# EAGLE design FetchControllerV2R2 (EAGLE 9.6.2)
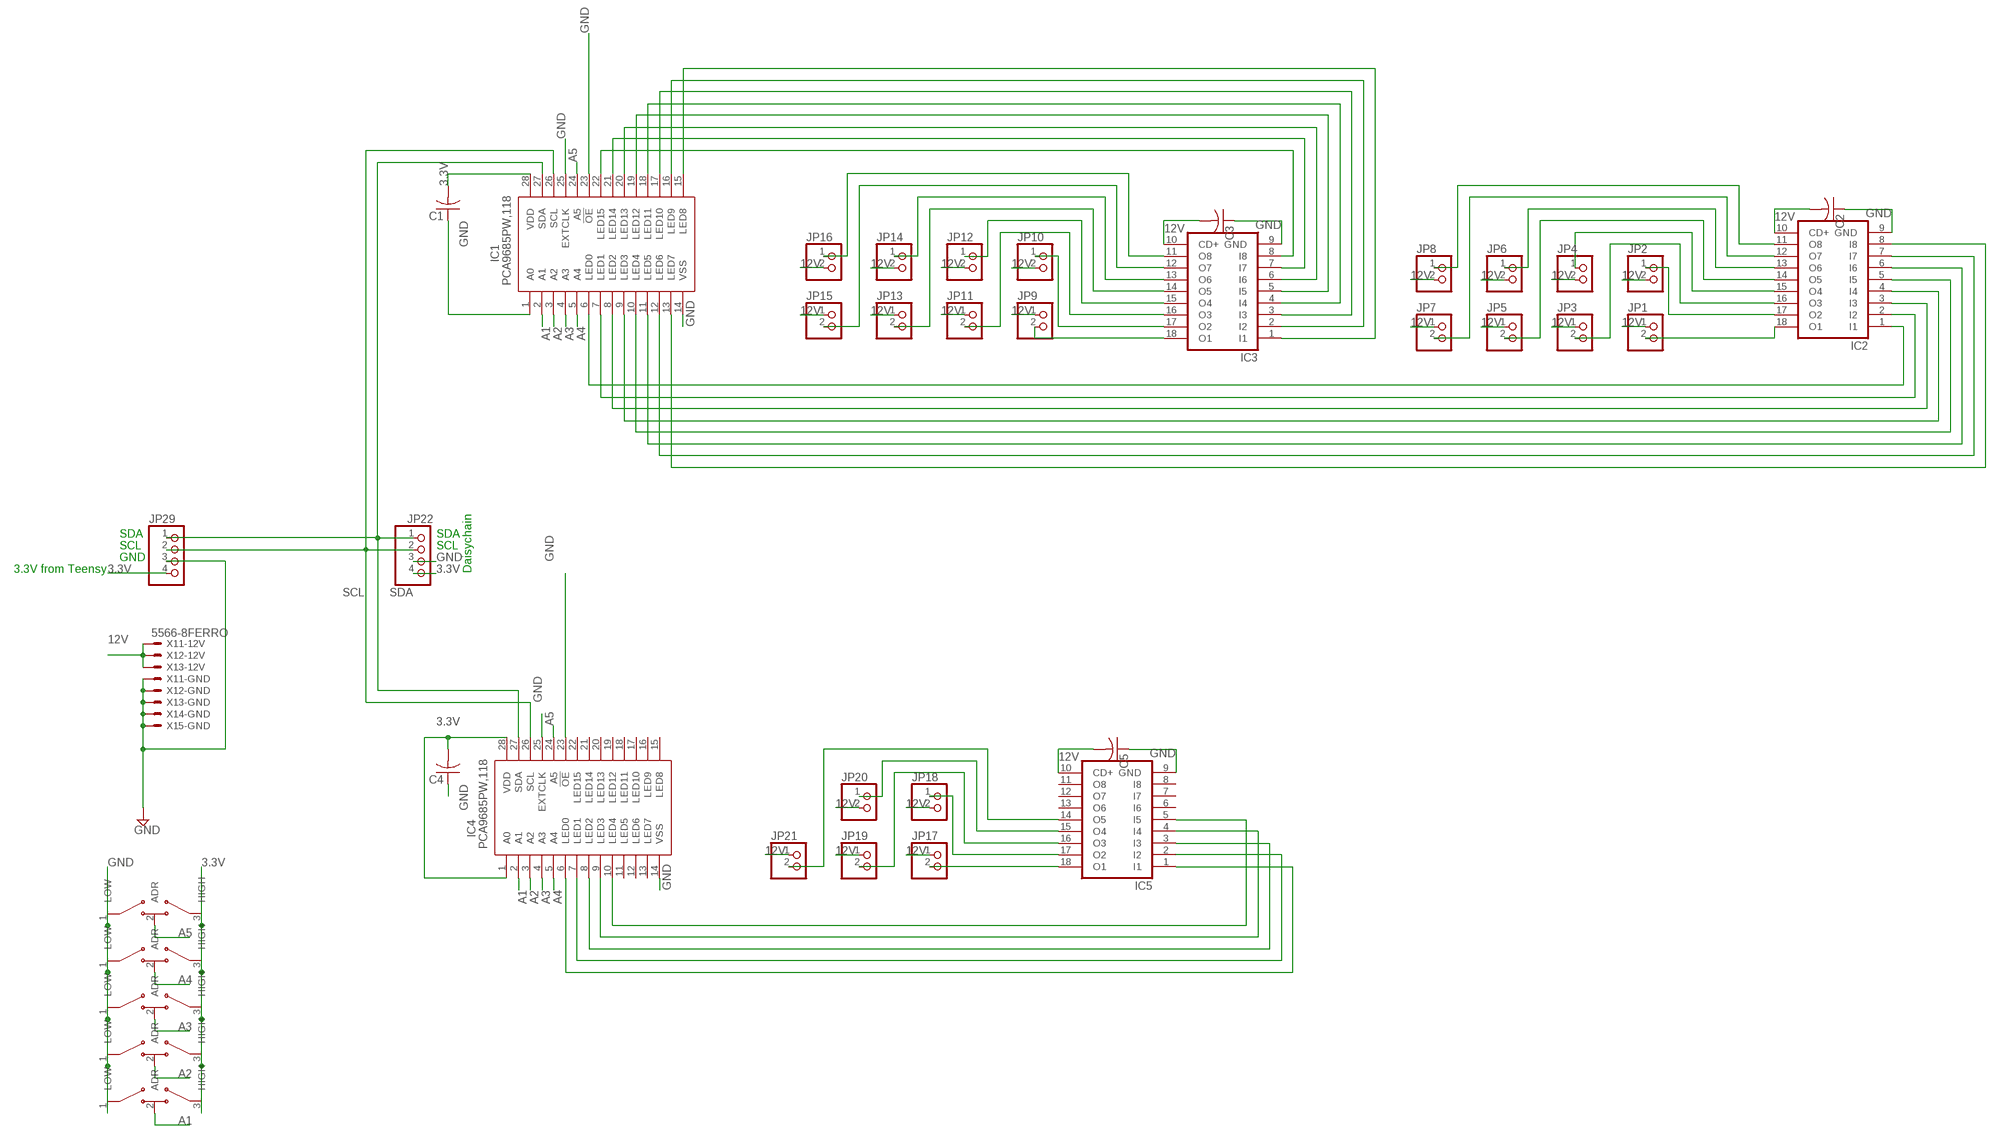
[diagram p0: schematic, sheet 1]

## Parts
C1  C-USC0603  [C0603]
C2  C-USC0603  [C0603]
C3  C-USC0603  [C0603]
C4  C-USC0603  [C0603]
C5  C-USC0603  [C0603]
IC1  PCA9685PW,118  [SOP65P640X110-28N]
IC2  ULN2803ASMT  [SO18W]
IC3  ULN2803ASMT  [SO18W]
IC4  PCA9685PW,118  [SOP65P640X110-28N]
IC5  ULN2803ASMT  [SO18W]
JP1  PINHD-1X2SOLENOID-R  [SOLENOID-CONTACT-REVERSE]
JP2  PINHD-1X2SOLENOID  [SOLENOID-CONTACT]
JP3  PINHD-1X2SOLENOID-R  [SOLENOID-CONTACT-REVERSE]
JP4  PINHD-1X2SOLENOID  [SOLENOID-CONTACT]
JP5  PINHD-1X2SOLENOID-R  [SOLENOID-CONTACT-REVERSE]
JP6  PINHD-1X2SOLENOID  [SOLENOID-CONTACT]
JP7  PINHD-1X2SOLENOID-R  [SOLENOID-CONTACT-REVERSE]
JP8  PINHD-1X2SOLENOID  [SOLENOID-CONTACT]
JP9  PINHD-1X2SOLENOID-R  [SOLENOID-CONTACT-REVERSE]
JP10  PINHD-1X2SOLENOID  [SOLENOID-CONTACT]
JP11  PINHD-1X2SOLENOID-R  [SOLENOID-CONTACT-REVERSE]
JP12  PINHD-1X2SOLENOID  [SOLENOID-CONTACT]
JP13  PINHD-1X2SOLENOID-R  [SOLENOID-CONTACT-REVERSE]
JP14  PINHD-1X2SOLENOID  [SOLENOID-CONTACT]
JP15  PINHD-1X2SOLENOID-R  [SOLENOID-CONTACT-REVERSE]
JP16  PINHD-1X2SOLENOID  [SOLENOID-CONTACT]
JP17  PINHD-1X2SOLENOID-R  [SOLENOID-CONTACT-REVERSE]
JP18  PINHD-1X2SOLENOID  [SOLENOID-CONTACT]
JP19  PINHD-1X2SOLENOID-R  [SOLENOID-CONTACT-REVERSE]
JP20  PINHD-1X2SOLENOID  [SOLENOID-CONTACT]
JP21  PINHD-1X2SOLENOID-R  [SOLENOID-CONTACT-REVERSE]
JP22  PINHD-1X4  [1X04]
JP29  PINHD-1X4  [1X04]
U$1  ADR-SELECT  [ADR-SELECT-SOLDER]
U$2  ADR-SELECT  [ADR-SELECT-SOLDER]
U$3  ADR-SELECT  [ADR-SELECT-SOLDER]
U$4  ADR-SELECT  [ADR-SELECT-SOLDER]
U$5  ADR-SELECT  [ADR-SELECT-SOLDER]
X1  5566-8FERRO  [5566-8-CLEAN]

## Nets
3.3V: C1.2 C4.2 IC1.28(VDD) IC4.1(A0) IC4.28(VDD) JP22.4 JP29.4 U$1.3(HIGH) U$2.3(HIGH) U$3.3(HIGH) U$4.3(HIGH) U$5.3(HIGH)
12V: C2.2 C3.2 C5.2 IC2.10(CD+) IC3.10(CD+) IC5.10(CD+) JP1.1 JP2.2 JP3.1 JP4.2 JP5.1 JP6.2 JP7.1 JP8.2 JP9.1 JP10.2 JP11.1 JP12.2 JP13.1 JP14.2 JP15.1 JP16.2 JP17.1 JP18.2 JP19.1 JP20.2 JP21.1 X1.1 X1.2 X1.3
A1: IC1.2(A1) IC4.2(A1) U$5.2(ADR)
A2: IC1.3(A2) IC4.3(A2) U$4.2(ADR)
A3: IC1.4(A3) IC4.4(A3) U$3.2(ADR)
A4: IC1.5(A4) IC4.5(A4) U$2.2(ADR)
A5: IC1.24(A5) IC4.24(A5) U$1.2(ADR)
GND: C1.1 C2.1 C3.1 C4.1 C5.1 IC1.1(A0) IC1.14(VSS) IC1.23(!OE) IC1.25(EXTCLK) IC2.9(GND) IC3.9(GND) IC4.14(VSS) IC4.23(!OE) IC4.25(EXTCLK) IC5.9(GND) JP22.3 JP29.3 U$1.1(LOW) U$2.1(LOW) U$3.1(LOW) U$4.1(LOW) U$5.1(LOW) X1.4 X1.5 X1.6 X1.7 X1.8
N$1: IC2.18(O1) JP1.2
N$2: IC1.13(LED7) IC2.8(I8)
N$3: IC4.7(LED1) IC5.2(I2)
N$4: IC2.17(O2) JP2.1
N$5: IC2.16(O3) JP3.2
N$6: IC4.9(LED3) IC5.4(I4)
N$8: IC2.15(O4) JP4.1
N$9: IC2.14(O5) JP5.2
N$10: IC2.13(O6) JP6.1
N$11: IC2.12(O7) JP7.2
N$12: IC2.11(O8) JP8.1
N$13: IC3.18(O1) JP9.2
N$14: IC3.17(O2) JP10.1
N$15: IC3.16(O3) JP11.2
N$16: IC3.15(O4) JP12.1
N$17: IC3.14(O5) JP13.2
N$18: IC3.13(O6) JP14.1
N$19: IC3.12(O7) JP15.2
N$20: IC3.11(O8) JP16.1
N$21: IC4.6(LED0) IC5.1(I1)
N$22: IC4.8(LED2) IC5.3(I3)
N$23: IC4.10(LED4) IC5.5(I5)
N$37: IC5.18(O1) JP17.2
N$38: IC5.17(O2) JP18.1
N$39: IC5.16(O3) JP19.2
N$40: IC5.15(O4) JP20.1
N$41: IC5.14(O5) JP21.2
N$78: IC1.6(LED0) IC2.1(I1)
N$82: IC1.8(LED2) IC2.3(I3)
N$84: IC1.10(LED4) IC2.5(I5)
N$86: IC1.12(LED6) IC2.7(I7)
N$89: IC1.15(LED8) IC3.1(I1)
N$90: IC1.16(LED9) IC3.2(I2)
N$91: IC1.17(LED10) IC3.3(I3)
N$92: IC1.18(LED11) IC3.4(I4)
N$93: IC1.19(LED12) IC3.5(I5)
N$94: IC1.20(LED13) IC3.6(I6)
N$95: IC1.21(LED14) IC3.7(I7)
N$96: IC1.22(LED15) IC3.8(I8)
N$97: IC1.11(LED5) IC2.6(I6)
N$99: IC1.9(LED3) IC2.4(I4)
N$101: IC1.7(LED1) IC2.2(I2)
SCL: IC1.26(SCL) IC4.26(SCL) JP22.2 JP29.2
SDA: IC1.27(SDA) IC4.27(SDA) JP22.1 JP29.1
Unconnected: IC4.11(LED5) IC4.12(LED6) IC4.13(LED7) IC4.15(LED8) IC4.16(LED9) IC4.17(LED10) IC4.18(LED11) IC4.19(LED12) IC4.20(LED13) IC4.21(LED14) IC4.22(LED15) IC5.6(I6) IC5.7(I7) IC5.8(I8) IC5.11(O8) IC5.12(O7) IC5.13(O6)

## Notes on the sheet
- SDA | SDA
- SCL | SCL
- GND
- 3.3V from Teensy | Daisychain

## Library data of the parts
C1-C5 = resistor:C-US: CAPACITOR, American symbol
IC1 IC4 = SamacSys_Parts:PCA9685PW,118: LED Display Drivers Source: Datasheet <https://componentsearchengine.com/Datasheets/1/PCA9685PW,118.pdf>; DESCRIPTION: LED Display Drivers; HEIGHT: 1.1mm; MANUFACTURER_NAME: NXP; MANUFACTURER_PART_NUMBER: PCA9685PW,118; MOUSER_PART_NUMBER: 771-PCA9685PW,118; MOUSER_PRICE-STOCK: https://www.mouser.com/Search/Refine.aspx?Keyword=771-PCA9685PW%2C118
IC2 IC3 IC5 = uln-udn-custom:ULN2803A: DRIVER ARRAY https://www.ti.com/lit/ds/symlink/uln2803a.pdf; DATASHEET: https://www.ti.com/lit/ds/symlink/uln2803a.pdf; INPUTVOLT: 3-5V; PARALLELIO: 8
JP1-JP21 = pinhead-custom:PINHD-1X2: PIN HEADER
JP22 JP29 = pinhead-custom:PINHD-1X4: PIN HEADER
U$1-U$5 = 00-Random-Components-Simen:ADR-SELECT
X1 = con-molex-custom:5566-8: Mini FIT connector 8 pol Source: http://www.molex.com

## Board
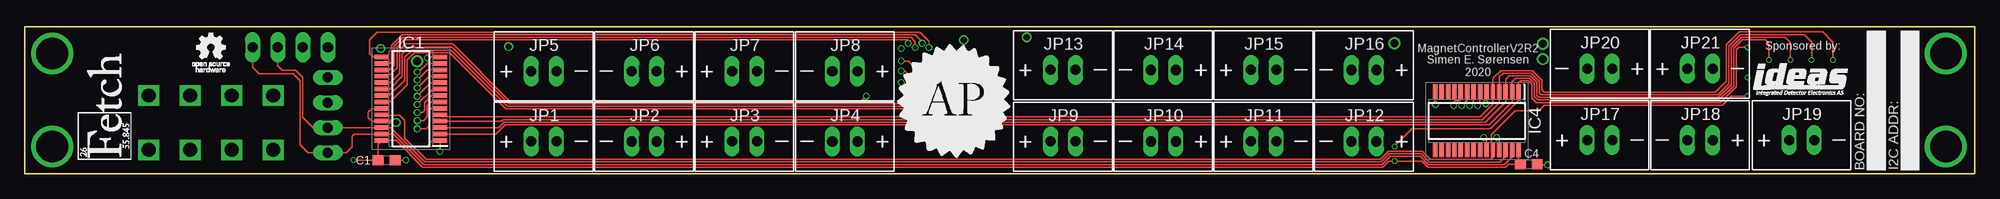
[diagram p1: board, top side]
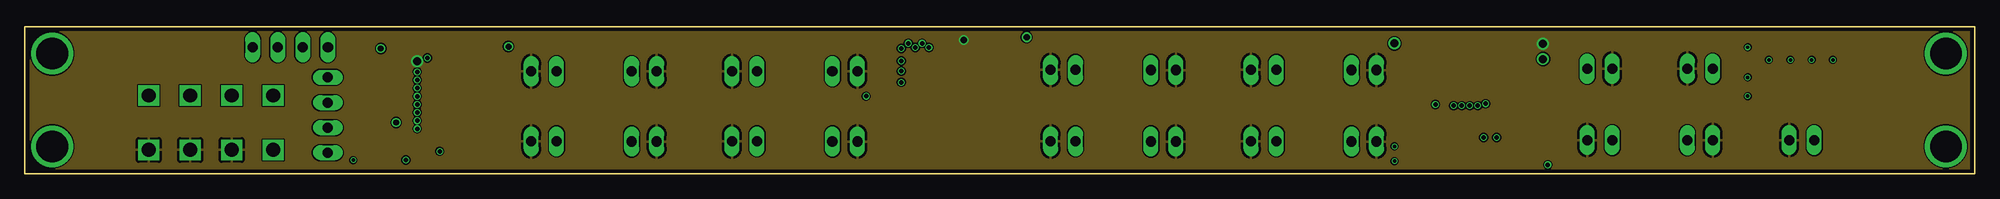
[diagram p2: board, inner layer 12V]
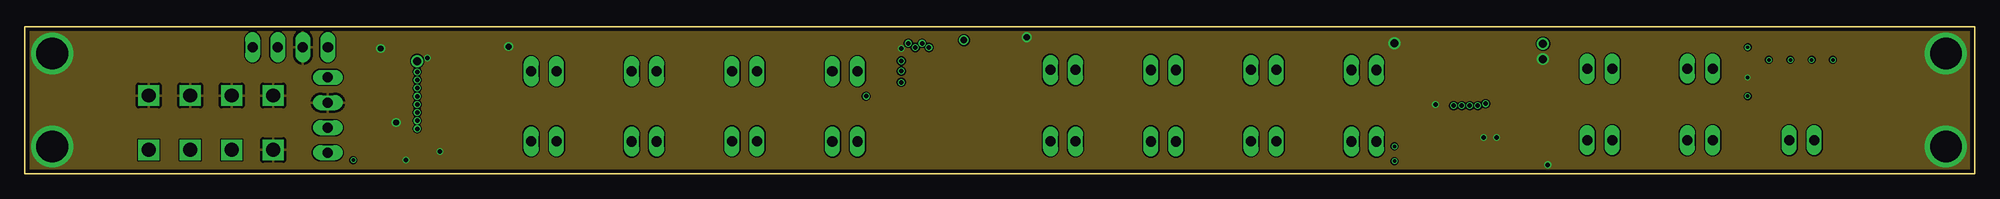
[diagram p3: board, inner layer GND]
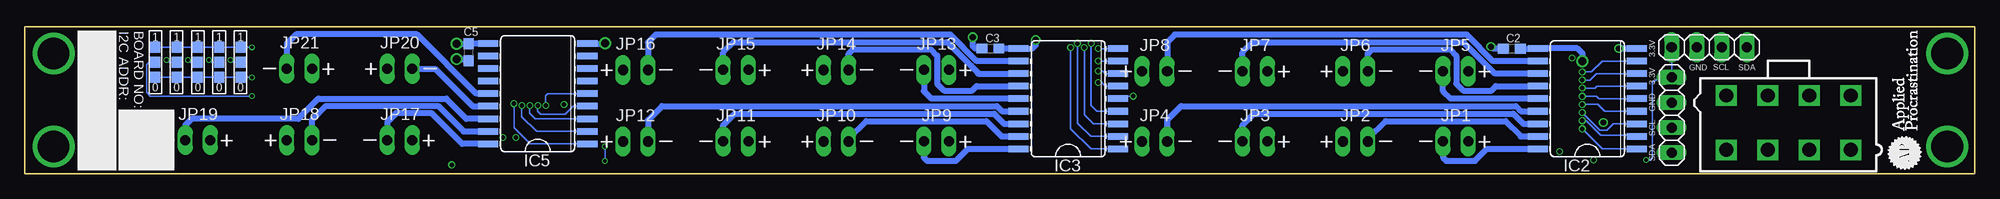
[diagram p4: board, bottom side, seen from below]

Size 197.5 x 14.9 mm. Coordinates in mm from the lower left corner, seen from the top.
Outline: 0,0 197.5,0 197.5,14.9 0,14.9 0,0
Copper layers (1*2*15*16): Top 0.035559375mm / dielectric 0.17018125mm / 12V 0.01778125mm / dielectric 47mil / GND 0.01778125mm / dielectric 0.17018125mm / Bottom 0.035559375mm
Design rules "oshpark-4layer *": minimum track width 5mil, minimum drill 10mil, track to track 5mil, track to pad 5mil, pad to pad 5mil, via to via 5mil, smd to smd 5mil, copper to edge 15mil, drill to drill 6mil, minimum pad ring 4mil, minimum via ring 4mil, stop-mask expansion 2.5mil, vias tented up to drill 50mil, thermal gap 10mil

### Footprints (pad centres in the part's own frame; a part is rotated, then mirrored left to right if it is on the bottom)
C0603 = smd 1.1 x 1: 1 -0.85,0; 2 0.85,0
SOP65P640X110-28N = smd 1.475 x 0.45: 1 -2.938,4.225; 2 -2.938,3.575; 3 -2.938,2.925; 4 -2.938,2.275; 5 -2.938,1.625; 6 -2.938,0.975; 7 -2.938,0.325; 8 -2.938,-0.325; 9 -2.938,-0.975; 10 -2.938,-1.625; 11 -2.938,-2.275; 12 -2.938,-2.925; 13 -2.938,-3.575; 14 -2.938,-4.225; 15 2.938,-4.225; 16 2.938,-3.575; 17 2.938,-2.925; 18 2.938,-2.275; 19 2.938,-1.625; 20 2.938,-0.975; 21 2.938,-0.325; 22 2.938,0.325; 23 2.938,0.975; 24 2.938,1.625; 25 2.938,2.275; 26 2.938,2.925; 27 2.938,3.575; 28 2.938,4.225
SO18W = smd 0.66 x 2.032: 1 -5.08,-5.029; 2 -3.81,-5.029; 3 -2.54,-5.029; 4 -1.27,-5.029; 5 0,-5.029; 6 1.27,-5.029; 7 2.54,-5.029; 8 3.81,-5.029; 9 5.08,-5.029; 10 5.08,5.029; 11 3.81,5.029; 12 2.54,5.029; 13 1.27,5.029; 14 0,5.029; 15 -1.27,5.029; 16 -2.54,5.029; 17 -3.81,5.029; 18 -5.08,5.029
SOLENOID-CONTACT-REVERSE = drill 1.016 long: 1 -1.267,-0.013; 2 1.273,-0.013
SOLENOID-CONTACT = drill 1.016 long: 1 -1.267,-0.017; 2 1.273,-0.017
1X04 = drill 1.016 long: 1 -3.81,0; 2 -1.27,0; 3 1.27,0; 4 3.81,0
ADR-SELECT-SOLDER = smd 1.1 x 1: 1 -1.524,0; 2 0,0; 3 1.524,0
5566-8-CLEAN = drill 1.4 square: 1 6.325,-3.436; 2 2.125,-3.436; 3 -2.075,-3.436; 4 -6.275,-3.436; 5 6.325,2.064; 6 2.125,2.064; 7 -2.075,2.064; 8 -6.275,2.064

### Placement (x,y rotation side)
C1  36.66,1.39 180 top
C2  46.88,12.69 0 bottom
C3  99.69,12.7 0 bottom
C4  152.32,0.98 180 top
C5  152.53,12.32 90 bottom
IC1  39.12,7.62 180 top
IC2  39.24,7.62 90 bottom
IC3  91.82,7.62 90 bottom
IC4  147.07,5.38 270 top
IC5  145.54,8.13 90 bottom
JP1  52.58,3.3 0 top
JP2  62.74,3.3 0 top
JP3  72.9,3.3 0 top
JP4  83.06,3.3 0 top
JP5  52.58,10.41 0 top
JP6  62.74,10.41 0 top
JP7  72.9,10.41 0 top
JP8  83.06,10.41 0 top
JP9  105.16,3.3 0 top
JP10  115.32,3.3 0 top
JP11  125.48,3.3 0 top
JP12  135.64,3.3 0 top
JP13  105.16,10.54 0 top
JP14  115.32,10.54 0 top
JP15  125.48,10.54 0 top
JP16  135.64,10.54 0 top
JP17  159.51,3.43 0 top
JP18  169.67,3.43 0 top
JP19  179.96,3.43 0 top
JP20  159.51,10.67 0 top
JP21  169.67,10.67 0 top
JP22  26.9,12.83 180 bottom
JP29  30.7,5.96 90 bottom
U$1  184.28,11.3 90 bottom
U$2  182.12,11.3 90 bottom
U$3  179.96,11.3 90 bottom
U$4  177.8,11.3 90 bottom
U$5  175.64,11.3 90 bottom
U$6  [APPLIED-PROC]  94.23,7.37 0 top
U$7  [FETCH]  8.13,6.86 90 top
U$8  [APPLIED-PROCRASTINATION-FULL-SMALL]  7.11,2.16 90 bottom
U$9  [IDEAS-LOGO-SMALL]  179.58,9.4 0 top
U$10  [OSHW-LOGO]  18.85,11.67 0 top
X1  18.89,5.87 0 bottom

### Tracks (layer width: path | path; a pad name or v marks a point on that pad's centre or on a via)
3.3V  (via drill 0.35)
  Top 0.127: C4.2 151.29,1.16 IC4.28 | C1.2 35.81,3.03 IC1.28 37.63,3.4 40.33,0.7 137.58,0.7 138.17,1.29 v138.72,1.29 141.48,1.29 142.09,0.69 149.98,0.69 150.28,0.98 C4.2 | v33.27,1.4 C1.2 | v138.72,2.78 140.51,4.57 148.46,4.57 151.29,7.4 IC4.1 151.29,9.23 151.51,9.45 152.27,9.45 152.65,9.07 152.65,7.67 153.11,7.21 171.7,7.21 171.73,7.24 171.75,7.24 173.35,8.84 173.35,12.57 173.61,12.83 v174.5,12.83
  Top 0.152: C1.2 | C4.2
  Bottom 0.127: v33.27,1.4 32.89,1.4 32.64,1.65 32.64,9.25 31.88,9.77 JP29.4 30.7,12.82 JP22.4 | v138.72,2.78 v138.72,1.29 | U$1.3 U$2.3 U$3.3 U$4.3 U$5.3 v174.5,12.83
12V  (via drill 0.65, 0.8)
  12V 0.61: v39.75,11.43 39.75,11.44
  Bottom 0.61: C2.2 IC2.10 44.26,12.71 40.26,12.71 39.74,12.2 v39.74,11.44 v39.75,11.43 | v95.12,13.55 95.12,13.04 95.46,12.7 IC3.10 C3.2 | C5.2 152.51,13.18 | v153.76,13.18 152.51,13.18 | IC5.10 152.49,13.21 152.51,13.18
  pour 12V: 0,0 197.1,0 197.1,14.99 0,14.99
A1  (via drill 0.35)
  Top 0.127: IC1.2 47.69,4.04 48.65,5 148.31,5 150.64,7.33 IC4.2 150.63,9.34 151,9.7 152.38,9.7 152.91,9.17 152.91,7.82 153.24,7.49 171.65,7.49 173.1,8.95 173.1,12.72 173.97,13.59 176.28,13.59 176.66,13.21 v176.66,11.56
  Bottom 0.127: v176.66,11.56 176.4,11.3 U$5.2
A2  (via drill 0.35)
  Top 0.127: IC1.3 47.98,4.7 48.54,5.26 147.96,5.26 149.99,7.29 IC4.3 149.99,9.58 150.37,9.96 152.48,9.96 153.16,9.28 153.16,7.92 153.34,7.75 171.54,7.75 172.85,9.05 172.85,12.83 173.86,13.84 178.31,13.84 178.82,13.34 v178.82,11.56
  Bottom 0.127: v178.82,11.56 178.56,11.3 U$4.2
A3  (via drill 0.35)
  Top 0.127: IC1.4 48.27,5.34 48.44,5.51 147.65,5.51 149.35,7.21 149.35,8.31 IC4.4 149.34,9.82 149.73,10.21 152.59,10.21 153.42,9.38 153.42,8.19 153.59,8.01 171.45,8.01 172.59,9.16 172.59,12.95 173.74,14.1 180.21,14.1 180.97,13.34 v180.97,11.56
  Bottom 0.127: v180.97,11.56 180.72,11.3 U$3.2
A4  (via drill 0.35)
  Top 0.127: IC1.5 42.26,5.79 147.42,5.79 148.69,7.06 IC4.5 148.69,9.68 149.48,10.46 152.69,10.46 153.67,9.49 153.67,8.51 153.91,8.27 171.21,8.27 172.34,9.4 172.34,13.08 173.64,14.38 182.09,14.38 183.13,13.34 v183.13,11.56
  Bottom 0.127: v183.13,11.56 182.88,11.3 U$2.2
A5  (via drill 0.35)
  Top 0.127: IC1.24 36.2,5.97 37.97,5.97 38.48,5.46 38.48,3.64 40.63,1.49 137.29,1.49 138.09,2.29 141.57,2.29 142.37,1.49 148.44,1.49 148.72,1.76 148.72,2.42 IC4.24 148.53,2.61 148.53,3.95 150.95,6.38 153.35,6.38 | v174.5,7.87 172.83,7.87 171.91,6.95 153.92,6.95
  Top 0.152: 153.35,6.38 153.92,6.95
  Bottom 0.152: U$1.2 184.91,11.3 185.17,11.05 185.17,8.26 184.78,7.87 v174.5,7.87
GND  (via drill 0.35, 0.45, 0.6, 0.65, 0.8, 3.2)
  Top 0.127: C1.1 37.51,1.41 v38.61,1.41 | IC1.14 41.14,11.85 41.11,11.81 40.84,11.81 v40.78,11.75 | IC1.1 42.05,2.3 v42.04,2.29 | v154.25,0.93 153.23,0.92 C4.1 | IC4.14 142.84,7.07 v142.88,7.04 | IC4.25 149.34,3.42 v149.06,3.7 | 36.14,6.6 35.18,6.6 34.8,6.22 34.8,5.71 35.17,5.34 IC1.25
  Top 0.152: IC1.23 36.14,6.6 | IC4.23 148.04,3.41 v147.76,3.69
  Top 0.406: v37.62,5.21 37.48,5.34 IC1.25
  Bottom 0.127: IC3.9 v88.77,12.7 | v174.5,9.78 U$5.1 U$4.1 U$3.1 U$2.1 U$1.1
  Bottom 0.61: IC2.9 v36.07,12.7 | v153.76,11.63 152.69,11.63 C5.1 | IC5.9 138.73,13.21 v138.72,13.22 | v48.99,12.9 48.78,12.69 C2.1 | C3.1 101.22,12.7 101.47,12.95 v101.47,13.84
  other vias: 194.56,12.19 194.56,2.79 2.79,12.19 2.79,2.79
  pour GND: 0,0 197.1,0 197.1,14.99 0,14.99
N$1
  Bottom 0.61: JP1.2 53.85,1.65 53.53,1.33 50.61,1.33 49.4,2.54 IC2.18
N$2  (via drill 0.45)
  Top 0.127: v39.75,10.33 39.92,10.33 40.79,11.2 IC1.13
  Bottom 0.127: v39.75,10.33 38.82,10.33 37.72,11.43 IC2.8
N$3  (via drill 0.45)
  Top 0.127: IC4.7 147.39,7.15 v147.16,6.92
  Bottom 0.127: v147.16,6.92 147.16,5.81 145.67,4.32 IC5.2
N$4
  Bottom 0.61: JP2.1 61.47,3.55 59.66,5.36 47.52,5.36 45.97,3.81 IC2.17
N$5
  Bottom 0.61: JP3.2 74.17,4.95 73.03,6.1 46.74,6.1 45.72,5.08 IC2.16
N$6  (via drill 0.45)
  Top 0.127: IC4.9 146.09,7.47 v145.54,6.92
  Bottom 0.127: v145.54,6.92 145.54,6.36 145.22,6.04 142.77,6.04 141.95,6.87 140.53,6.87 IC5.4
N$8
  Bottom 0.61: JP4.1 81.79,5.46 80.39,6.86 46.48,6.86 46.46,6.83 46.43,6.83 45.95,6.35 IC2.15
N$9
  Bottom 0.61: IC2.14 53.09,7.62 53.85,8.38 JP5.2
N$10
  Bottom 0.61: JP6.1 61.47,12.19 61.04,12.62 53.14,12.62 52.51,11.99 52.51,9.14 51.8,8.45 48.96,8.45 48.51,8.89 IC2.13
N$11
  Bottom 0.61: JP7.2 74.17,12.32 73.13,13.36 51.79,13.36 48.59,10.16 IC2.12
N$12
  Bottom 0.61: IC2.11 48.79,11.43 51.46,14.1 81.03,14.1 81.79,13.34 JP8.1
N$13
  Bottom 0.61: JP9.2 106.43,1.65 106.11,1.33 103.19,1.33 101.98,2.54 IC3.18
N$14
  Bottom 0.61: JP10.1 114.05,3.55 112.24,5.36 100.1,5.36 98.55,3.81 IC3.17
N$15
  Bottom 0.61: JP11.2 126.75,4.95 125.6,6.1 99.31,6.1 98.3,5.08 IC3.16
N$16
  Bottom 0.61: JP12.1 134.37,5.46 132.97,6.86 99.06,6.86 99.03,6.83 99.01,6.83 98.53,6.35 IC3.15
N$17
  Bottom 0.61: IC3.14 105.66,7.62 106.43,8.38 JP13.2
N$18
  Bottom 0.61: JP14.1 114.05,12.19 113.61,12.62 105.72,12.62 105.08,11.99 105.08,9.14 104.38,8.45 101.54,8.45 101.09,8.89 IC3.13
N$19
  Bottom 0.61: IC3.12 100.97,10.16 100.97,10.26 104.06,13.36 125.7,13.36 126.75,12.32 JP15.2
N$20
  Bottom 0.61: IC3.11 101.09,11.43 103.76,14.1 133.6,14.1 134.37,13.33 JP16.1
N$21  (via drill 0.45)
  Top 0.127: IC4.6 148.04,7.11 v147.96,7.11
  Bottom 0.127: v147.96,7.11 147.96,4.7 146.3,3.05 IC5.1
N$22  (via drill 0.45)
  Top 0.127: IC4.8 146.74,7.31 v146.35,6.92
  Bottom 0.127: v146.35,6.92 146.35,6.14 145.8,5.59 IC5.3
N$23  (via drill 0.45)
  Top 0.127: v144.73,6.92 144.73,7.24 144.88,7.39 145.25,7.39 145.28,7.39 145.44,7.56 IC4.10
  Bottom 0.127: IC5.5 144.53,8.13 144.73,7.93 v144.73,6.92
N$37
  Bottom 0.61: IC5.18 153.19,3.05 156.29,6.15 159.89,6.15 160.78,5.25 JP17.2
N$38
  Bottom 0.61: JP18.1 168.41,5.48 167,6.88 155.61,6.88 153.05,4.32 IC5.17
N$39
  Bottom 0.61: IC5.16 152.77,5.59 154.8,7.62 167.77,7.62 169.8,5.59 180.6,5.59 181.23,4.95 JP19.2
N$40
  Bottom 0.61: JP20.1 155.94,10.65 153.67,8.38 153.03,7.75 152.15,6.86 IC5.15
N$41
  Bottom 0.61: IC5.14 151.76,8.13 157.76,14.12 170.03,14.12 170.94,13.21 JP21.2
N$78  (via drill 0.45)
  Top 0.127: IC1.6 41.19,6.64 41.02,6.48 41.02,4.95 40.64,4.57 v39.75,4.57
  Bottom 0.127: IC2.1 37.72,2.54 v39.75,4.57
N$82  (via drill 0.45)
  Top 0.127: IC1.8 41.24,7.95 40.51,7.22 40.51,6.46 40.27,6.22 v39.75,6.22
  Bottom 0.127: IC2.3 36.63,5.08 37.26,4.45 37.99,4.45 39.75,6.2 v39.75,6.22
N$84  (via drill 0.45)
  Top 0.127: IC1.10 41.13,9.24 v39.75,7.86
  Bottom 0.127: IC2.5 38.1,7.62 38.35,7.87 39.74,7.87 v39.75,7.86
N$86  (via drill 0.45)
  Top 0.127: IC1.12 40.79,10.54 v39.75,9.51
  Bottom 0.127: IC2.7 38.35,10.16 39.01,9.51 v39.75,9.51
N$89  (via drill 0.45)
  Top 0.127: v91.58,12.8 91.58,13.45 90.67,14.36 35.71,14.36 34.92,13.58 34.92,12.19 35.27,11.85 IC1.15 | v91.58,12.8
  Bottom 0.127: IC3.1 89.53,2.54 91.58,4.58 v91.58,12.8
N$90  (via drill 0.45)
  Top 0.127: IC1.16 36.99,11.2 37.17,11.38 37.17,13.04 38.23,14.1 90.17,14.1 90.88,13.38 v90.88,13.23
  Bottom 0.127: v90.88,13.23 90.88,5.16 89.53,3.81 IC3.2
N$91  (via drill 0.45)
  Top 0.127: v90.19,12.8 90.19,13.41 89.75,13.84 38.35,13.84 37.43,12.92 37.43,10.99 36.99,10.54 IC1.17
  Bottom 0.127: IC3.3 89.28,5.08 90.18,5.98 v90.18,12.8 v90.19,12.8
N$92  (via drill 0.45)
  Top 0.127: IC1.18 36.32,10.03 36.99,10.03 37.71,10.74 37.71,12.81 38.46,13.56 89.39,13.56 89.49,13.46 v89.49,13.23
  Bottom 0.127: IC3.4 88.9,6.35 89.49,6.94 v89.49,13.23
N$93  (via drill 0.45)
  Top 0.127: v85.22,7.87 84.71,7.37 49.14,7.37 43.32,13.18 38.58,13.18 37.96,12.56 37.96,10.21 36.99,9.24 IC1.19
  Bottom 0.127: IC3.5 86.54,7.87 v85.22,7.87
N$94  (via drill 0.45)
  Top 0.127: v88.77,9.27 88.9,9.27 89.86,8.31 89.86,7.44 89.53,7.11 48.99,7.11 43.28,12.82 38.88,12.82 38.23,12.17 38.23,9.87 36.95,8.6 IC1.20
  Bottom 0.127: IC3.6 88.06,8.89 88.44,9.27 v88.77,9.27
N$95  (via drill 0.45)
  Top 0.127: v88.77,10.41 89.18,10.41 90.4,9.2 90.4,7.59 89.66,6.86 48.85,6.86 43.18,12.53 39.23,12.53 38.49,11.8 38.49,9.51 36.93,7.95 IC1.21
  Bottom 0.127: v88.77,10.41 88.32,10.41 88.06,10.16 IC3.7
N$96  (via drill 0.45)
  Top 0.127: v88.77,11.43 89.53,11.43 90.68,10.29 90.68,7.51 89.75,6.59 48.73,6.59 43.04,12.28 39.46,12.28 38.75,11.57 38.75,9.04 37,7.29 IC1.22
  Bottom 0.127: v88.77,11.43 IC3.8
N$97  (via drill 0.45)
  Top 0.127: IC1.11 40.96,9.89 v39.75,8.69
  Bottom 0.127: IC2.6 38.28,8.89 38.48,8.69 v39.75,8.69
N$99  (via drill 0.45)
  Top 0.127: IC1.9 41.3,8.6 v39.75,7.04
  Bottom 0.127: v39.75,7.04 38.16,7.04 37.47,6.35 IC2.4
N$101  (via drill 0.45)
  Top 0.127: IC1.7 41.14,7.29 40.77,6.92 40.77,5.78 40.38,5.39 v39.75,5.39
  Bottom 0.127: IC2.2 34.34,3.94 37.87,3.94 39.33,5.39 v39.75,5.39
SCL
  Top 0.127: IC1.26 37.07,4.7 40.53,1.23 137.39,1.23 138.19,2.03 141.46,2.03 142.29,1.21 149.42,1.21 149.99,1.78 IC4.26
  Top 0.152: IC1.26 JP29.2 | JP29.2 | JP29.2 29.21,4.7 28.17,5.74 28.17,9.77 27.45,10.49 26.1,10.49 25.63,10.96 JP22.2
SDA
  Top 0.127: IC1.27 37.36,4.04 40.45,0.95 137.47,0.95 138.3,1.78 141.36,1.78 142.18,0.95 149.87,0.95 150.62,1.7 150.62,2.43 IC4.27
  Top 0.152: IC1.27 33.38,4.04 33.15,3.81 33.15,2.75 32.55,2.15 JP29.1 30.68,2.13 28.73,2.13 27.89,2.97 27.89,9.45 27.22,10.12 23.76,10.12 23.09,10.79 JP22.1

### Text on the board
tPlace: Sponsored by: | MagnetControllerV2R2 | Simen E. Sørensen | 2020 | BOARD NO: | I2C ADDR:
bPlace: BOARD NO: | I2C ADDR: | GND
bNames: 3.3V | SDA | SCL | 3.3V | GND | SCL | SDA